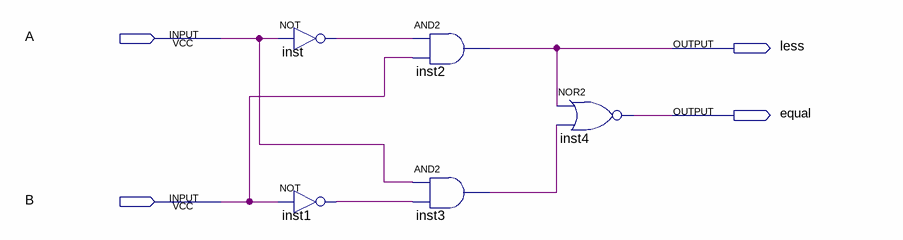
[diagram p0: schematic sheet]
// Quartus schematic compare_1bit.bdf as structural Verilog: 5 symbols, 4 pins
module compare_1bit (
  input  A,
  input  B,
  output less,
  output equal
);

  wire inst1_out, inst3_out, inst_out;

  not inst (inst_out, A);
  not inst1 (inst1_out, B);
  and inst2 (less, inst_out, B);
  and inst3 (inst3_out, A, inst1_out);
  nor inst4 (equal, less, inst3_out);
endmodule
